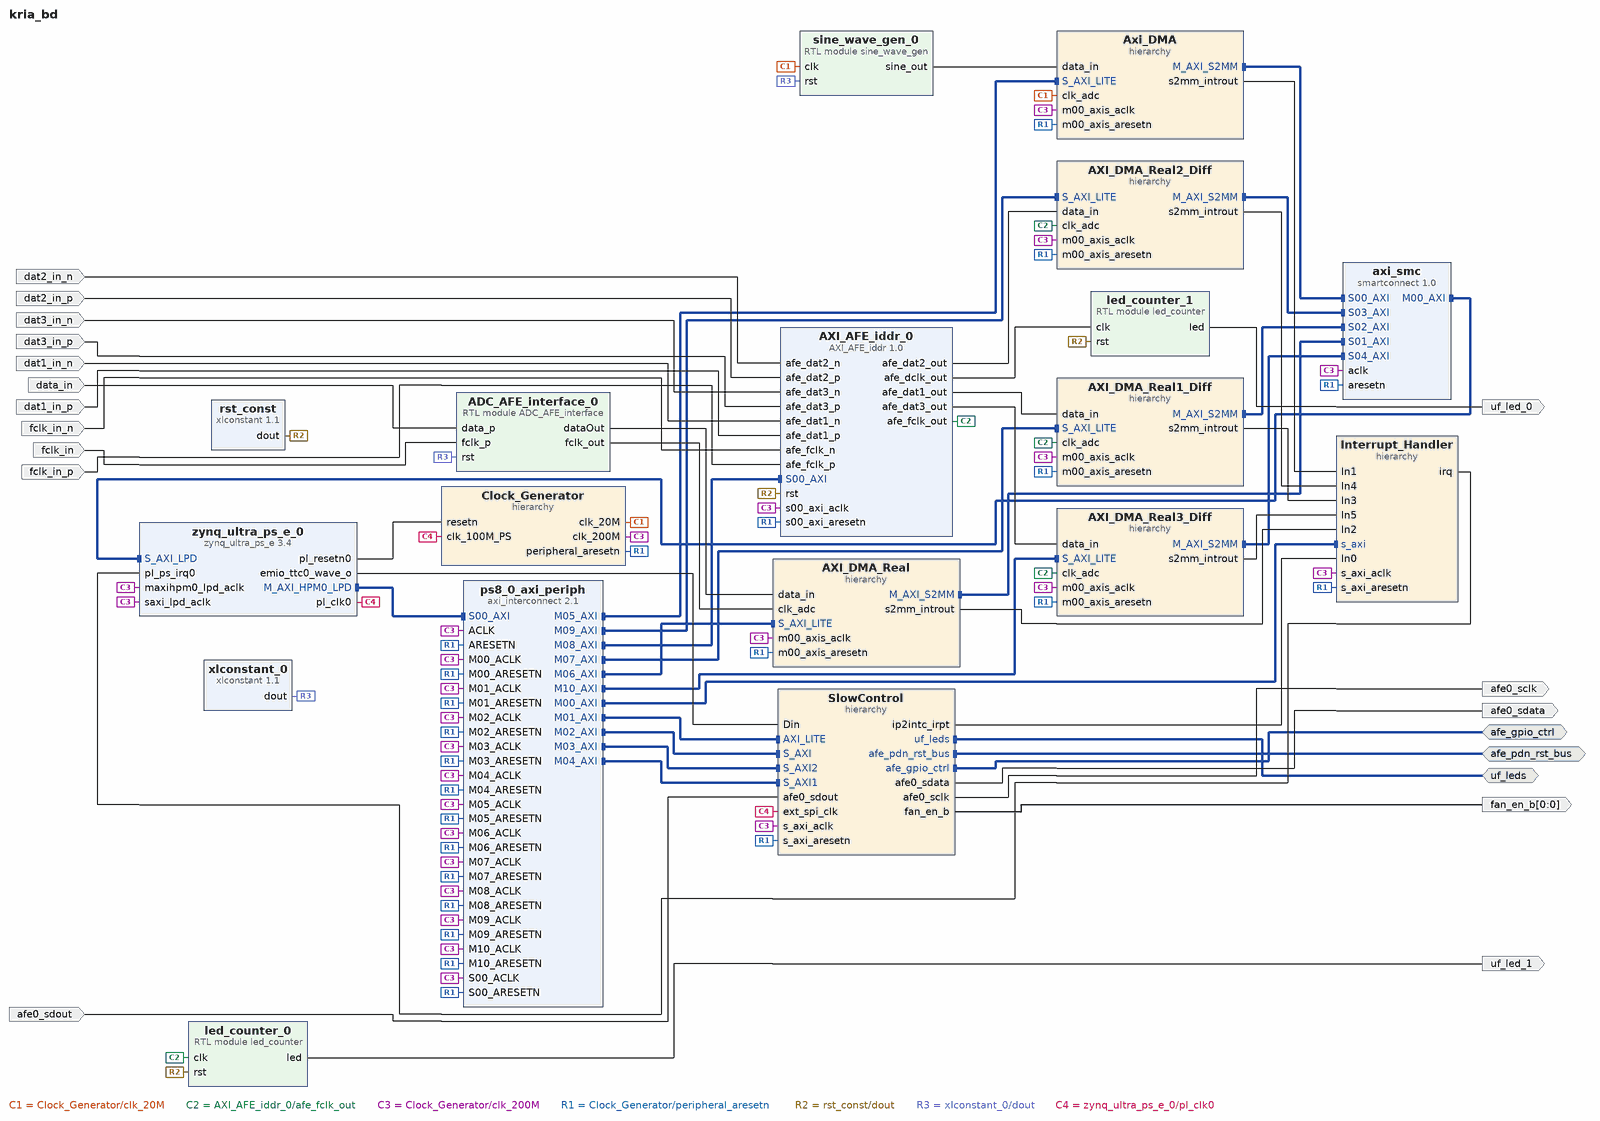
[diagram p0: block diagram of the top level]
# Vivado block design kria_bd, xck26-sfvc784-2LV-c, Vivado 2022.2
create_bd_design kria_bd

create_bd_intf_port -mode Master -vlnv xilinx.com:interface:gpio_rtl:1.0 afe_gpio_ctrl
create_bd_intf_port -mode Master -vlnv xilinx.com:interface:gpio_rtl:1.0 afe_pdn_rst_bus
create_bd_intf_port -mode Master -vlnv xilinx.com:interface:gpio_rtl:1.0 uf_leds
create_bd_port -dir O afe0_sclk
create_bd_port -dir O afe0_sdata
create_bd_port -dir I afe0_sdout
create_bd_port -dir O -from 0 -to 0 fan_en_b
create_bd_port -dir I fclk_in
create_bd_port -dir I data_in
create_bd_port -dir I fclk_in_n
create_bd_port -dir I fclk_in_p
create_bd_port -dir O uf_led_0
create_bd_port -dir O uf_led_1
create_bd_port -dir I dat1_in_p
create_bd_port -dir I dat1_in_n
create_bd_port -dir I dat2_in_p
create_bd_port -dir I dat3_in_n
create_bd_port -dir I dat2_in_n
create_bd_port -dir I dat3_in_p

create_bd_cell -type hier SlowControl
create_bd_cell -type hier Interrupt_Handler
create_bd_cell -type hier Clock_Generator
create_bd_cell -type ip -vlnv xilinx.com:ip:zynq_ultra_ps_e:3.4 zynq_ultra_ps_e_0
set_property -dict [list \
  CONFIG.CAN0_BOARD_INTERFACE custom \
  CONFIG.CAN1_BOARD_INTERFACE custom \
  CONFIG.CSU_BOARD_INTERFACE custom \
  CONFIG.DP_BOARD_INTERFACE custom \
  CONFIG.GEM0_BOARD_INTERFACE custom \
  CONFIG.GEM1_BOARD_INTERFACE custom \
  CONFIG.GEM2_BOARD_INTERFACE custom \
  CONFIG.GEM3_BOARD_INTERFACE custom \
  CONFIG.GPIO_BOARD_INTERFACE custom \
  CONFIG.IIC0_BOARD_INTERFACE custom \
  CONFIG.IIC1_BOARD_INTERFACE custom \
  CONFIG.NAND_BOARD_INTERFACE custom \
  CONFIG.PCIE_BOARD_INTERFACE custom \
  CONFIG.PJTAG_BOARD_INTERFACE custom \
  CONFIG.PMU_BOARD_INTERFACE custom \
  CONFIG.PSU_BANK_0_IO_STANDARD LVCMOS18 \
  CONFIG.PSU_BANK_1_IO_STANDARD LVCMOS18 \
  CONFIG.PSU_BANK_2_IO_STANDARD LVCMOS18 \
  CONFIG.PSU_BANK_3_IO_STANDARD LVCMOS18 \
  CONFIG.PSU_USB3__DUAL_CLOCK_ENABLE 1 \
  CONFIG.PSU__CAN1__PERIPHERAL__ENABLE 0 \
  CONFIG.PSU__CRF_APB__ACPU_CTRL__FREQMHZ 1333.333 \
  CONFIG.PSU__CRF_APB__ACPU_CTRL__SRCSEL APLL \
  CONFIG.PSU__CRF_APB__APLL_CTRL__SRCSEL PSS_REF_CLK \
  CONFIG.PSU__CRF_APB__APLL_FRAC_CFG__ENABLED 1 \
  CONFIG.PSU__CRF_APB__DBG_FPD_CTRL__FREQMHZ 250 \
  CONFIG.PSU__CRF_APB__DBG_FPD_CTRL__SRCSEL IOPLL \
  CONFIG.PSU__CRF_APB__DBG_TRACE_CTRL__FREQMHZ 250 \
  CONFIG.PSU__CRF_APB__DBG_TRACE_CTRL__SRCSEL IOPLL \
  CONFIG.PSU__CRF_APB__DBG_TSTMP_CTRL__FREQMHZ 250 \
  CONFIG.PSU__CRF_APB__DBG_TSTMP_CTRL__SRCSEL IOPLL \
  CONFIG.PSU__CRF_APB__DDR_CTRL__FREQMHZ 1200 \
  CONFIG.PSU__CRF_APB__DDR_CTRL__SRCSEL DPLL \
  CONFIG.PSU__CRF_APB__DPDMA_REF_CTRL__FREQMHZ 600 \
  CONFIG.PSU__CRF_APB__DPDMA_REF_CTRL__SRCSEL APLL \
  CONFIG.PSU__CRF_APB__DPLL_CTRL__SRCSEL PSS_REF_CLK \
  CONFIG.PSU__CRF_APB__DP_AUDIO_REF_CTRL__SRCSEL RPLL \
  CONFIG.PSU__CRF_APB__DP_STC_REF_CTRL__SRCSEL RPLL \
  CONFIG.PSU__CRF_APB__DP_VIDEO_REF_CTRL__SRCSEL VPLL \
  CONFIG.PSU__CRF_APB__GDMA_REF_CTRL__FREQMHZ 600 \
  CONFIG.PSU__CRF_APB__GDMA_REF_CTRL__SRCSEL DPLL \
  CONFIG.PSU__CRF_APB__GPU_REF_CTRL__FREQMHZ 600 \
  CONFIG.PSU__CRF_APB__GPU_REF_CTRL__SRCSEL IOPLL \
  CONFIG.PSU__CRF_APB__TOPSW_LSBUS_CTRL__FREQMHZ 100 \
  CONFIG.PSU__CRF_APB__TOPSW_LSBUS_CTRL__SRCSEL IOPLL \
  CONFIG.PSU__CRF_APB__TOPSW_MAIN_CTRL__FREQMHZ 533.33 \
  CONFIG.PSU__CRF_APB__TOPSW_MAIN_CTRL__SRCSEL DPLL \
  CONFIG.PSU__CRF_APB__VPLL_CTRL__SRCSEL PSS_REF_CLK \
  CONFIG.PSU__CRL_APB__ADMA_REF_CTRL__FREQMHZ 500 \
  CONFIG.PSU__CRL_APB__ADMA_REF_CTRL__SRCSEL IOPLL \
  CONFIG.PSU__CRL_APB__CAN1_REF_CTRL__FREQMHZ 100 \
  CONFIG.PSU__CRL_APB__CAN1_REF_CTRL__SRCSEL IOPLL \
  CONFIG.PSU__CRL_APB__CPU_R5_CTRL__FREQMHZ 533.333 \
  CONFIG.PSU__CRL_APB__CPU_R5_CTRL__SRCSEL RPLL \
  CONFIG.PSU__CRL_APB__DBG_LPD_CTRL__FREQMHZ 250 \
  CONFIG.PSU__CRL_APB__DBG_LPD_CTRL__SRCSEL IOPLL \
  CONFIG.PSU__CRL_APB__GEM3_REF_CTRL__FREQMHZ 125 \
  CONFIG.PSU__CRL_APB__GEM3_REF_CTRL__SRCSEL IOPLL \
  CONFIG.PSU__CRL_APB__I2C0_REF_CTRL__FREQMHZ 100 \
  CONFIG.PSU__CRL_APB__I2C0_REF_CTRL__SRCSEL IOPLL \
  CONFIG.PSU__CRL_APB__I2C1_REF_CTRL__FREQMHZ 100 \
  CONFIG.PSU__CRL_APB__I2C1_REF_CTRL__SRCSEL IOPLL \
  CONFIG.PSU__CRL_APB__IOPLL_CTRL__SRCSEL PSS_REF_CLK \
  CONFIG.PSU__CRL_APB__IOU_SWITCH_CTRL__FREQMHZ 250 \
  CONFIG.PSU__CRL_APB__IOU_SWITCH_CTRL__SRCSEL IOPLL \
  CONFIG.PSU__CRL_APB__LPD_LSBUS_CTRL__FREQMHZ 100 \
  CONFIG.PSU__CRL_APB__LPD_LSBUS_CTRL__SRCSEL IOPLL \
  CONFIG.PSU__CRL_APB__LPD_SWITCH_CTRL__FREQMHZ 500 \
  CONFIG.PSU__CRL_APB__LPD_SWITCH_CTRL__SRCSEL IOPLL \
  CONFIG.PSU__CRL_APB__PCAP_CTRL__FREQMHZ 200 \
  CONFIG.PSU__CRL_APB__PCAP_CTRL__SRCSEL IOPLL \
  CONFIG.PSU__CRL_APB__PL0_REF_CTRL__FREQMHZ 100 \
  CONFIG.PSU__CRL_APB__PL0_REF_CTRL__SRCSEL IOPLL \
  CONFIG.PSU__CRL_APB__PL1_REF_CTRL__SRCSEL IOPLL \
  CONFIG.PSU__CRL_APB__QSPI_REF_CTRL__FREQMHZ 125 \
  CONFIG.PSU__CRL_APB__QSPI_REF_CTRL__SRCSEL IOPLL \
  CONFIG.PSU__CRL_APB__RPLL_CTRL__SRCSEL PSS_REF_CLK \
  CONFIG.PSU__CRL_APB__SDIO1_REF_CTRL__FREQMHZ 200 \
  CONFIG.PSU__CRL_APB__SDIO1_REF_CTRL__SRCSEL RPLL \
  CONFIG.PSU__CRL_APB__SPI1_REF_CTRL__SRCSEL IOPLL \
  CONFIG.PSU__CRL_APB__TIMESTAMP_REF_CTRL__FREQMHZ 100 \
  CONFIG.PSU__CRL_APB__TIMESTAMP_REF_CTRL__SRCSEL IOPLL \
  CONFIG.PSU__CRL_APB__UART0_REF_CTRL__FREQMHZ 100 \
  CONFIG.PSU__CRL_APB__UART0_REF_CTRL__SRCSEL IOPLL \
  CONFIG.PSU__CRL_APB__UART1_REF_CTRL__FREQMHZ 100 \
  CONFIG.PSU__CRL_APB__UART1_REF_CTRL__SRCSEL IOPLL \
  CONFIG.PSU__CRL_APB__USB0_BUS_REF_CTRL__FREQMHZ 250 \
  CONFIG.PSU__CRL_APB__USB0_BUS_REF_CTRL__SRCSEL IOPLL \
  CONFIG.PSU__CRL_APB__USB3_DUAL_REF_CTRL__FREQMHZ 20 \
  CONFIG.PSU__CRL_APB__USB3_DUAL_REF_CTRL__SRCSEL IOPLL \
  CONFIG.PSU__CRL_APB__USB3__ENABLE 1 \
  CONFIG.PSU__CSUPMU__PERIPHERAL__VALID 1 \
  CONFIG.PSU__DDRC__BUS_WIDTH {64 Bit} \
  CONFIG.PSU__DDRC__COMPONENTS Components \
  CONFIG.PSU__DDRC__DEVICE_CAPACITY {8192 MBits} \
  CONFIG.PSU__DDRC__DRAM_WIDTH {16 Bits} \
  CONFIG.PSU__DDRC__ECC Disabled \
  CONFIG.PSU__DDRC__MEMORY_TYPE {DDR 4} \
  CONFIG.PSU__DDRC__SPEED_BIN DDR4_2400R \
  CONFIG.PSU__DDR_HIGH_ADDRESS_GUI_ENABLE 1 \
  CONFIG.PSU__DDR__INTERFACE__FREQMHZ 600.000 \
  CONFIG.PSU__DEVICE_TYPE EV \
  CONFIG.PSU__DISPLAYPORT__LANE0__ENABLE 1 \
  CONFIG.PSU__DISPLAYPORT__LANE0__IO {GT Lane1} \
  CONFIG.PSU__DISPLAYPORT__LANE1__ENABLE 0 \
  CONFIG.PSU__DISPLAYPORT__PERIPHERAL__ENABLE 1 \
  CONFIG.PSU__DLL__ISUSED 0 \
  CONFIG.PSU__DPAUX__PERIPHERAL__ENABLE 1 \
  CONFIG.PSU__DPAUX__PERIPHERAL__IO {MIO 27 .. 30} \
  CONFIG.PSU__DP__LANE_SEL {Single Lower} \
  CONFIG.PSU__DP__REF_CLK_FREQ 27 \
  CONFIG.PSU__DP__REF_CLK_SEL {Ref Clk2} \
  CONFIG.PSU__ENET0__PERIPHERAL__ENABLE 1 \
  CONFIG.PSU__ENET0__PERIPHERAL__IO {GT Lane0} \
  CONFIG.PSU__ENET1__GRP_MDIO__ENABLE 1 \
  CONFIG.PSU__ENET1__GRP_MDIO__IO {MIO 50 .. 51} \
  CONFIG.PSU__ENET1__PERIPHERAL__ENABLE 1 \
  CONFIG.PSU__ENET1__PERIPHERAL__IO {MIO 38 .. 49} \
  CONFIG.PSU__ENET3__PERIPHERAL__ENABLE 0 \
  CONFIG.PSU__FPGA_PL0_ENABLE 1 \
  CONFIG.PSU__FPGA_PL1_ENABLE 1 \
  CONFIG.PSU__GEM0__REF_CLK_FREQ 125 \
  CONFIG.PSU__GEM0__REF_CLK_SEL {Ref Clk1} \
  CONFIG.PSU__GEM__TSU__ENABLE 0 \
  CONFIG.PSU__GPIO0_MIO__IO {MIO 0 .. 25} \
  CONFIG.PSU__GPIO0_MIO__PERIPHERAL__ENABLE 1 \
  CONFIG.PSU__GPIO1_MIO__IO {MIO 26 .. 51} \
  CONFIG.PSU__GPIO1_MIO__PERIPHERAL__ENABLE 1 \
  CONFIG.PSU__GPIO_EMIO__WIDTH {[91:0]} \
  CONFIG.PSU__GT__LINK_SPEED HBR \
  CONFIG.PSU__GT__PRE_EMPH_LVL_4 0 \
  CONFIG.PSU__GT__VLT_SWNG_LVL_4 0 \
  CONFIG.PSU__I2C0__PERIPHERAL__ENABLE 0 \
  CONFIG.PSU__I2C1__PERIPHERAL__ENABLE 1 \
  CONFIG.PSU__I2C1__PERIPHERAL__IO {MIO 24 .. 25} \
  CONFIG.PSU__IOU_SLCR__IOU_TTC_APB_CLK__TTC0_SEL APB \
  CONFIG.PSU__IOU_SLCR__IOU_TTC_APB_CLK__TTC1_SEL APB \
  CONFIG.PSU__IOU_SLCR__IOU_TTC_APB_CLK__TTC2_SEL APB \
  CONFIG.PSU__IOU_SLCR__IOU_TTC_APB_CLK__TTC3_SEL APB \
  CONFIG.PSU__NUM_FABRIC_RESETS 4 \
  CONFIG.PSU__OVERRIDE_HPX_QOS 0 \
  CONFIG.PSU__OVERRIDE__BASIC_CLOCK 0 \
  CONFIG.PSU__PMU_COHERENCY 0 \
  CONFIG.PSU__PMU__AIBACK__ENABLE 0 \
  CONFIG.PSU__PMU__EMIO_GPI__ENABLE 0 \
  CONFIG.PSU__PMU__EMIO_GPO__ENABLE 0 \
  CONFIG.PSU__PMU__GPI0__ENABLE 1 \
  CONFIG.PSU__PMU__GPI0__IO {MIO 26} \
  CONFIG.PSU__PMU__GPI1__ENABLE 0 \
  CONFIG.PSU__PMU__GPI2__ENABLE 0 \
  CONFIG.PSU__PMU__GPI3__ENABLE 0 \
  CONFIG.PSU__PMU__GPI4__ENABLE 0 \
  CONFIG.PSU__PMU__GPI5__ENABLE 1 \
  CONFIG.PSU__PMU__GPI5__IO {MIO 31} \
  CONFIG.PSU__PMU__GPO0__ENABLE 1 \
  CONFIG.PSU__PMU__GPO0__IO {MIO 32} \
  CONFIG.PSU__PMU__GPO1__ENABLE 1 \
  CONFIG.PSU__PMU__GPO1__IO {MIO 33} \
  CONFIG.PSU__PMU__GPO2__ENABLE 1 \
  CONFIG.PSU__PMU__GPO2__IO {MIO 34} \
  CONFIG.PSU__PMU__GPO2__POLARITY high \
  CONFIG.PSU__PMU__GPO3__ENABLE 1 \
  CONFIG.PSU__PMU__GPO3__IO {MIO 35} \
  CONFIG.PSU__PMU__GPO3__POLARITY low \
  CONFIG.PSU__PMU__GPO4__ENABLE 0 \
  CONFIG.PSU__PMU__GPO5__ENABLE 0 \
  CONFIG.PSU__PMU__PERIPHERAL__ENABLE 1 \
  CONFIG.PSU__PMU__PLERROR__ENABLE 0 \
  CONFIG.PSU__PRESET_APPLIED 1 \
  CONFIG.PSU__PSS_REF_CLK__FREQMHZ 33.333 \
  CONFIG.PSU__QSPI_COHERENCY 0 \
  CONFIG.PSU__QSPI_ROUTE_THROUGH_FPD 0 \
  CONFIG.PSU__QSPI__GRP_FBCLK__ENABLE 0 \
  CONFIG.PSU__QSPI__PERIPHERAL__DATA_MODE x4 \
  CONFIG.PSU__QSPI__PERIPHERAL__ENABLE 1 \
  CONFIG.PSU__QSPI__PERIPHERAL__IO {MIO 0 .. 5} \
  CONFIG.PSU__QSPI__PERIPHERAL__MODE Single \
  CONFIG.PSU__SATA__PERIPHERAL__ENABLE 0 \
  CONFIG.PSU__SD0__CLK_100_SDR_OTAP_DLY 0x3 \
  CONFIG.PSU__SD0__CLK_200_SDR_OTAP_DLY 0x3 \
  CONFIG.PSU__SD0__CLK_50_DDR_ITAP_DLY 0x3D \
  CONFIG.PSU__SD0__CLK_50_DDR_OTAP_DLY 0x4 \
  CONFIG.PSU__SD0__CLK_50_SDR_ITAP_DLY 0x15 \
  CONFIG.PSU__SD0__CLK_50_SDR_OTAP_DLY 0x5 \
  CONFIG.PSU__SD1__CLK_100_SDR_OTAP_DLY 0x3 \
  CONFIG.PSU__SD1__CLK_200_SDR_OTAP_DLY 0x3 \
  CONFIG.PSU__SD1__CLK_50_DDR_ITAP_DLY 0x3D \
  CONFIG.PSU__SD1__CLK_50_DDR_OTAP_DLY 0x4 \
  CONFIG.PSU__SD1__CLK_50_SDR_ITAP_DLY 0x15 \
  CONFIG.PSU__SD1__CLK_50_SDR_OTAP_DLY 0x5 \
  CONFIG.PSU__SD1__PERIPHERAL__ENABLE 0 \
  CONFIG.PSU__SPI1__GRP_SS0__IO {MIO 9} \
  CONFIG.PSU__SPI1__PERIPHERAL__ENABLE 1 \
  CONFIG.PSU__SPI1__PERIPHERAL__IO {MIO 6 .. 11} \
  CONFIG.PSU__SWDT0__CLOCK__ENABLE 0 \
  CONFIG.PSU__SWDT0__PERIPHERAL__ENABLE 1 \
  CONFIG.PSU__SWDT0__RESET__ENABLE 0 \
  CONFIG.PSU__SWDT1__CLOCK__ENABLE 0 \
  CONFIG.PSU__SWDT1__PERIPHERAL__ENABLE 1 \
  CONFIG.PSU__SWDT1__RESET__ENABLE 0 \
  CONFIG.PSU__TSU__BUFG_PORT_PAIR 0 \
  CONFIG.PSU__TTC0__CLOCK__ENABLE 0 \
  CONFIG.PSU__TTC0__PERIPHERAL__ENABLE 1 \
  CONFIG.PSU__TTC0__WAVEOUT__ENABLE 1 \
  CONFIG.PSU__TTC0__WAVEOUT__IO EMIO \
  CONFIG.PSU__TTC1__CLOCK__ENABLE 0 \
  CONFIG.PSU__TTC1__PERIPHERAL__ENABLE 1 \
  CONFIG.PSU__TTC1__WAVEOUT__ENABLE 0 \
  CONFIG.PSU__TTC2__CLOCK__ENABLE 0 \
  CONFIG.PSU__TTC2__PERIPHERAL__ENABLE 1 \
  CONFIG.PSU__TTC2__WAVEOUT__ENABLE 0 \
  CONFIG.PSU__TTC3__CLOCK__ENABLE 0 \
  CONFIG.PSU__TTC3__PERIPHERAL__ENABLE 1 \
  CONFIG.PSU__TTC3__WAVEOUT__ENABLE 0 \
  CONFIG.PSU__UART0__PERIPHERAL__ENABLE 0 \
  CONFIG.PSU__UART1__BAUD_RATE 115200 \
  CONFIG.PSU__UART1__MODEM__ENABLE 0 \
  CONFIG.PSU__UART1__PERIPHERAL__ENABLE 1 \
  CONFIG.PSU__UART1__PERIPHERAL__IO {MIO 36 .. 37} \
  CONFIG.PSU__USB0_COHERENCY 0 \
  CONFIG.PSU__USB0__PERIPHERAL__ENABLE 1 \
  CONFIG.PSU__USB0__PERIPHERAL__IO {MIO 52 .. 63} \
  CONFIG.PSU__USB0__REF_CLK_FREQ 26 \
  CONFIG.PSU__USB0__REF_CLK_SEL {Ref Clk3} \
  CONFIG.PSU__USB0__RESET__ENABLE 1 \
  CONFIG.PSU__USB0__RESET__IO {MIO 76} \
  CONFIG.PSU__USB1__PERIPHERAL__ENABLE 1 \
  CONFIG.PSU__USB1__PERIPHERAL__IO {MIO 64 .. 75} \
  CONFIG.PSU__USB1__REF_CLK_FREQ 26 \
  CONFIG.PSU__USB1__REF_CLK_SEL {Ref Clk3} \
  CONFIG.PSU__USB1__RESET__ENABLE 1 \
  CONFIG.PSU__USB1__RESET__IO {MIO 77} \
  CONFIG.PSU__USB2_0__EMIO__ENABLE 0 \
  CONFIG.PSU__USB3_0__EMIO__ENABLE 0 \
  CONFIG.PSU__USB3_0__PERIPHERAL__ENABLE 1 \
  CONFIG.PSU__USB3_0__PERIPHERAL__IO {GT Lane2} \
  CONFIG.PSU__USB3_1__PERIPHERAL__ENABLE 1 \
  CONFIG.PSU__USB3_1__PERIPHERAL__IO {GT Lane3} \
  CONFIG.PSU__USB__RESET__MODE {Separate MIO Pin} \
  CONFIG.PSU__USB__RESET__POLARITY {Active Low} \
  CONFIG.PSU__USE__IRQ0 1 \
  CONFIG.PSU__USE__M_AXI_GP0 0 \
  CONFIG.PSU__USE__M_AXI_GP1 0 \
  CONFIG.PSU__USE__M_AXI_GP2 1 \
  CONFIG.PSU__USE__S_AXI_GP6 1 \
  CONFIG.QSPI_BOARD_INTERFACE custom \
  CONFIG.SATA_BOARD_INTERFACE custom \
  CONFIG.SD0_BOARD_INTERFACE custom \
  CONFIG.SD1_BOARD_INTERFACE custom \
  CONFIG.SPI0_BOARD_INTERFACE custom \
  CONFIG.SPI1_BOARD_INTERFACE custom \
  CONFIG.SUBPRESET1 Custom \
  CONFIG.SUBPRESET2 Custom \
  CONFIG.SWDT0_BOARD_INTERFACE custom \
  CONFIG.SWDT1_BOARD_INTERFACE custom \
  CONFIG.TRACE_BOARD_INTERFACE custom \
  CONFIG.TTC0_BOARD_INTERFACE custom \
  CONFIG.TTC1_BOARD_INTERFACE custom \
  CONFIG.TTC2_BOARD_INTERFACE custom \
  CONFIG.TTC3_BOARD_INTERFACE custom \
  CONFIG.UART0_BOARD_INTERFACE custom \
  CONFIG.UART1_BOARD_INTERFACE custom \
  CONFIG.USB0_BOARD_INTERFACE custom \
  CONFIG.USB1_BOARD_INTERFACE custom \
  CONFIG.preset None \
] [get_bd_cells zynq_ultra_ps_e_0]
# 740 more settings of zynq_ultra_ps_e_0 are not shown: defaults, MIO pin electricals, DDR timing, and values the tool derives
create_bd_cell -type ip -vlnv xilinx.com:ip:axi_interconnect:2.1 ps8_0_axi_periph
set_property -dict {CONFIG.NUM_MI 11} [get_bd_cells ps8_0_axi_periph]
create_bd_cell -type ip -vlnv xilinx.com:ip:xlconstant:1.1 xlconstant_0
set_property -dict {CONFIG.CONST_VAL 0} [get_bd_cells xlconstant_0]
create_bd_cell -type hier Axi_DMA
create_bd_cell -type ip -vlnv xilinx.com:ip:smartconnect:1.0 axi_smc
set_property -dict {CONFIG.NUM_SI 5} [get_bd_cells axi_smc]
create_bd_cell -type hier AXI_DMA_Real
create_bd_cell -type hier AXI_DMA_Real1_Diff
create_bd_cell -type module -reference sine_wave_gen sine_wave_gen_0
create_bd_cell -type module -reference ADC_AFE_interface ADC_AFE_interface_0
create_bd_cell -type ip -vlnv xilinx.com:ip:xlconstant:1.1 rst_const
set_property -dict {CONFIG.CONST_VAL 0} [get_bd_cells rst_const]
create_bd_cell -type module -reference led_counter led_counter_0
create_bd_cell -type module -reference led_counter led_counter_1
create_bd_cell -type hier AXI_DMA_Real2_Diff
create_bd_cell -type hier AXI_DMA_Real3_Diff
create_bd_cell -type ip -vlnv xilinx.com:user:AXI_AFE_iddr:1.0 AXI_AFE_iddr_0
set_property -dict {CONFIG.NUMBER_CHANNELS 3} [get_bd_cells AXI_AFE_iddr_0]

# ---- hierarchy /SlowControl ----
current_bd_instance /SlowControl
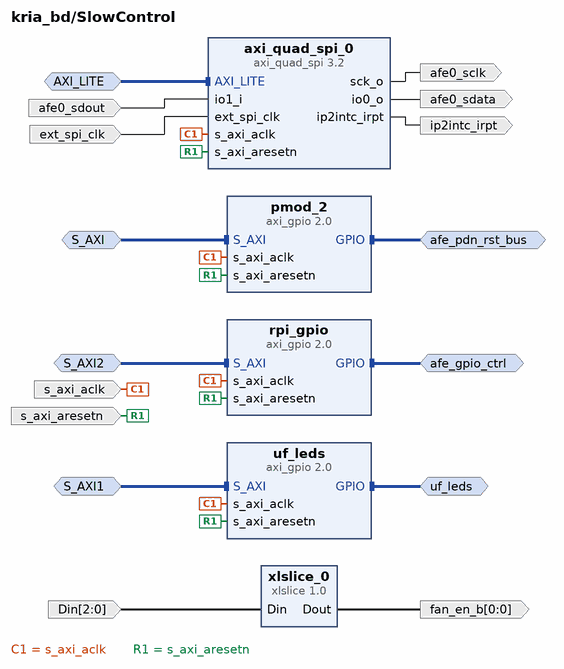
[diagram p1: block diagram inside /SlowControl]
create_bd_intf_pin -mode Slave -vlnv xilinx.com:interface:aximm_rtl:1.0 S_AXI
create_bd_intf_pin -mode Master -vlnv xilinx.com:interface:gpio_rtl:1.0 afe_pdn_rst_bus
create_bd_intf_pin -mode Slave -vlnv xilinx.com:interface:aximm_rtl:1.0 S_AXI1
create_bd_intf_pin -mode Master -vlnv xilinx.com:interface:gpio_rtl:1.0 uf_leds
create_bd_intf_pin -mode Slave -vlnv xilinx.com:interface:aximm_rtl:1.0 S_AXI2
create_bd_intf_pin -mode Master -vlnv xilinx.com:interface:gpio_rtl:1.0 afe_gpio_ctrl
create_bd_intf_pin -mode Slave -vlnv xilinx.com:interface:aximm_rtl:1.0 AXI_LITE
create_bd_pin -dir I -type clk s_axi_aclk
create_bd_pin -dir I -type rst s_axi_aresetn
create_bd_pin -dir I -type clk ext_spi_clk
create_bd_pin -dir O afe0_sdata
create_bd_pin -dir I afe0_sdout
create_bd_pin -dir O afe0_sclk
create_bd_pin -dir O -type intr ip2intc_irpt
create_bd_pin -dir I -from 2 -to 0 Din
create_bd_pin -dir O -from 0 -to 0 fan_en_b

create_bd_cell -type ip -vlnv xilinx.com:ip:axi_gpio:2.0 pmod_2
set_property -dict {CONFIG.C_GPIO_WIDTH 2} [get_bd_cells pmod_2]
create_bd_cell -type ip -vlnv xilinx.com:ip:axi_gpio:2.0 uf_leds
set_property -dict {CONFIG.C_GPIO_WIDTH 2} [get_bd_cells uf_leds]
create_bd_cell -type ip -vlnv xilinx.com:ip:axi_gpio:2.0 rpi_gpio
set_property -dict {CONFIG.C_GPIO_WIDTH 1} [get_bd_cells rpi_gpio]
create_bd_cell -type ip -vlnv xilinx.com:ip:axi_quad_spi:3.2 axi_quad_spi_0
set_property -dict {CONFIG.C_SCK_RATIO 16} [get_bd_cells axi_quad_spi_0]
create_bd_cell -type ip -vlnv xilinx.com:ip:xlslice:1.0 xlslice_0
set_property -dict {CONFIG.DIN_FROM 2 CONFIG.DIN_TO 2 CONFIG.DIN_WIDTH 3} [get_bd_cells xlslice_0]

# ---- hierarchy /Interrupt_Handler ----
current_bd_instance /Interrupt_Handler
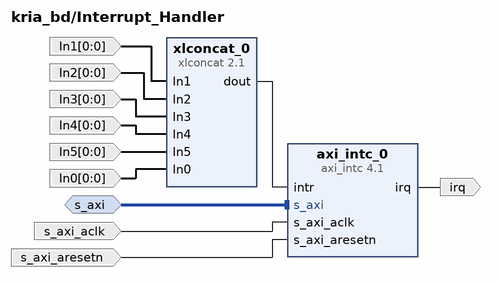
[diagram p2: block diagram inside /Interrupt_Handler]
create_bd_intf_pin -mode Slave -vlnv xilinx.com:interface:aximm_rtl:1.0 s_axi
create_bd_pin -dir I -from 0 -to 0 In0
create_bd_pin -dir I -type clk s_axi_aclk
create_bd_pin -dir I -type rst s_axi_aresetn
create_bd_pin -dir O -type intr irq
create_bd_pin -dir I -from 0 -to 0 In1
create_bd_pin -dir I -from 0 -to 0 In2
create_bd_pin -dir I -from 0 -to 0 In3
create_bd_pin -dir I -from 0 -to 0 In4
create_bd_pin -dir I -from 0 -to 0 In5

create_bd_cell -type ip -vlnv xilinx.com:ip:xlconcat:2.1 xlconcat_0
set_property -dict {CONFIG.NUM_PORTS 6} [get_bd_cells xlconcat_0]
create_bd_cell -type ip -vlnv xilinx.com:ip:axi_intc:4.1 axi_intc_0
set_property -dict {CONFIG.C_IRQ_CONNECTION 1} [get_bd_cells axi_intc_0]

# ---- hierarchy /Clock_Generator ----
current_bd_instance /Clock_Generator
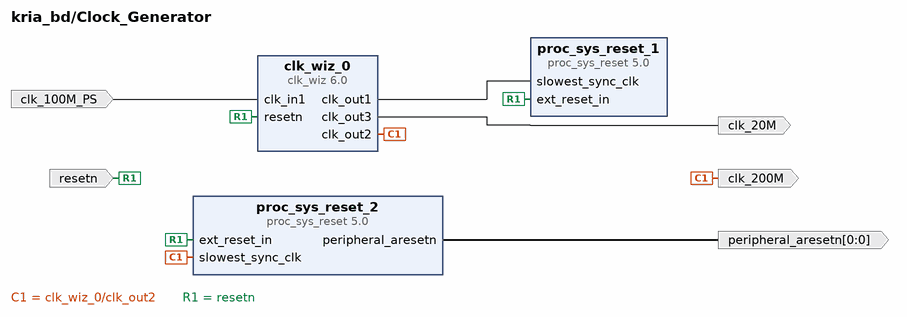
[diagram p3: block diagram inside /Clock_Generator]
create_bd_pin -dir I -type rst resetn
create_bd_pin -dir I -type clk clk_100M_PS
create_bd_pin -dir O -type clk clk_200M
create_bd_pin -dir O -from 0 -to 0 -type rst peripheral_aresetn
create_bd_pin -dir O -type clk clk_20M

create_bd_cell -type ip -vlnv xilinx.com:ip:proc_sys_reset:5.0 proc_sys_reset_1
create_bd_cell -type ip -vlnv xilinx.com:ip:clk_wiz:6.0 clk_wiz_0
set_property -dict [list \
  CONFIG.CLKOUT2_JITTER 102.087 \
  CONFIG.CLKOUT2_PHASE_ERROR 87.181 \
  CONFIG.CLKOUT2_REQUESTED_OUT_FREQ 200.000 \
  CONFIG.CLKOUT2_USED true \
  CONFIG.CLKOUT3_JITTER 162.169 \
  CONFIG.CLKOUT3_PHASE_ERROR 87.181 \
  CONFIG.CLKOUT3_REQUESTED_OUT_FREQ 20 \
  CONFIG.CLKOUT3_USED true \
  CONFIG.MMCM_CLKOUT1_DIVIDE 6 \
  CONFIG.MMCM_CLKOUT2_DIVIDE 60 \
  CONFIG.NUM_OUT_CLKS 3 \
  CONFIG.RESET_PORT resetn \
  CONFIG.RESET_TYPE ACTIVE_LOW \
] [get_bd_cells clk_wiz_0]
create_bd_cell -type ip -vlnv xilinx.com:ip:proc_sys_reset:5.0 proc_sys_reset_2

# ---- hierarchy /Axi_DMA ----
current_bd_instance /Axi_DMA
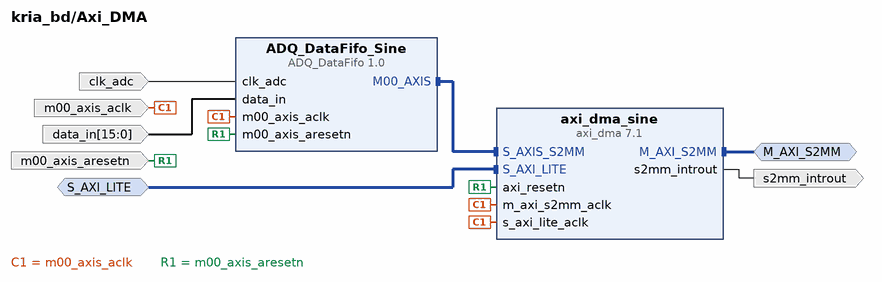
[diagram p4: block diagram inside /Axi_DMA]
create_bd_intf_pin -mode Slave -vlnv xilinx.com:interface:aximm_rtl:1.0 S_AXI_LITE
create_bd_intf_pin -mode Master -vlnv xilinx.com:interface:aximm_rtl:1.0 M_AXI_S2MM
create_bd_pin -dir I -type clk m00_axis_aclk
create_bd_pin -dir I -type rst m00_axis_aresetn
create_bd_pin -dir O -type intr s2mm_introut
create_bd_pin -dir I -from 15 -to 0 data_in
create_bd_pin -dir I clk_adc

create_bd_cell -type ip -vlnv xilinx.com:ip:axi_dma:7.1 axi_dma_sine
set_property -dict [list \
  CONFIG.c_include_mm2s 0 \
  CONFIG.c_include_sg 0 \
  CONFIG.c_s2mm_burst_size 256 \
  CONFIG.c_sg_length_width 16 \
] [get_bd_cells axi_dma_sine]
create_bd_cell -type ip -vlnv fabian.castano:Dune:ADQ_DataFifo:1.0 ADQ_DataFifo_Sine

# ---- hierarchy /AXI_DMA_Real ----
current_bd_instance /AXI_DMA_Real
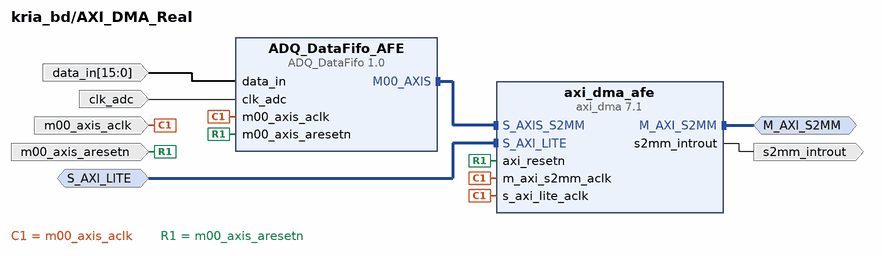
[diagram p5: block diagram inside /AXI_DMA_Real]
create_bd_intf_pin -mode Master -vlnv xilinx.com:interface:aximm_rtl:1.0 M_AXI_S2MM
create_bd_intf_pin -mode Slave -vlnv xilinx.com:interface:aximm_rtl:1.0 S_AXI_LITE
create_bd_pin -dir I -from 15 -to 0 data_in
create_bd_pin -dir I clk_adc
create_bd_pin -dir O -type intr s2mm_introut
create_bd_pin -dir I -type clk m00_axis_aclk
create_bd_pin -dir I -type rst m00_axis_aresetn

create_bd_cell -type ip -vlnv fabian.castano:Dune:ADQ_DataFifo:1.0 ADQ_DataFifo_AFE
create_bd_cell -type ip -vlnv xilinx.com:ip:axi_dma:7.1 axi_dma_afe
set_property -dict [list \
  CONFIG.c_include_mm2s 0 \
  CONFIG.c_include_sg 0 \
  CONFIG.c_s2mm_burst_size 256 \
  CONFIG.c_sg_length_width 16 \
] [get_bd_cells axi_dma_afe]

# ---- hierarchy /AXI_DMA_Real1_Diff ----
current_bd_instance /AXI_DMA_Real1_Diff
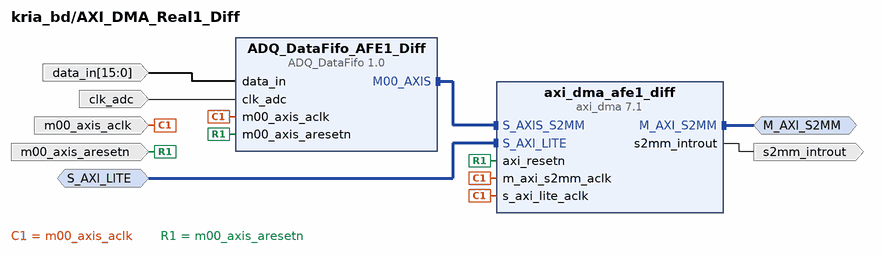
[diagram p6: block diagram inside /AXI_DMA_Real1_Diff]
create_bd_intf_pin -mode Master -vlnv xilinx.com:interface:aximm_rtl:1.0 M_AXI_S2MM
create_bd_intf_pin -mode Slave -vlnv xilinx.com:interface:aximm_rtl:1.0 S_AXI_LITE
create_bd_pin -dir I -from 15 -to 0 data_in
create_bd_pin -dir I clk_adc
create_bd_pin -dir O -type intr s2mm_introut
create_bd_pin -dir I -type clk m00_axis_aclk
create_bd_pin -dir I -type rst m00_axis_aresetn

create_bd_cell -type ip -vlnv fabian.castano:Dune:ADQ_DataFifo:1.0 ADQ_DataFifo_AFE1_Diff
create_bd_cell -type ip -vlnv xilinx.com:ip:axi_dma:7.1 axi_dma_afe1_diff
set_property -dict [list \
  CONFIG.c_include_mm2s 0 \
  CONFIG.c_include_sg 0 \
  CONFIG.c_s2mm_burst_size 256 \
  CONFIG.c_sg_length_width 16 \
] [get_bd_cells axi_dma_afe1_diff]

# ---- hierarchy /AXI_DMA_Real2_Diff ----
current_bd_instance /AXI_DMA_Real2_Diff
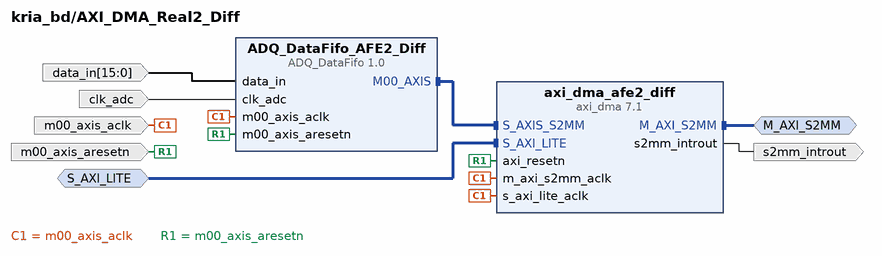
[diagram p7: block diagram inside /AXI_DMA_Real2_Diff]
create_bd_intf_pin -mode Master -vlnv xilinx.com:interface:aximm_rtl:1.0 M_AXI_S2MM
create_bd_intf_pin -mode Slave -vlnv xilinx.com:interface:aximm_rtl:1.0 S_AXI_LITE
create_bd_pin -dir I -from 15 -to 0 data_in
create_bd_pin -dir I clk_adc
create_bd_pin -dir O -type intr s2mm_introut
create_bd_pin -dir I -type clk m00_axis_aclk
create_bd_pin -dir I -type rst m00_axis_aresetn

create_bd_cell -type ip -vlnv fabian.castano:Dune:ADQ_DataFifo:1.0 ADQ_DataFifo_AFE2_Diff
create_bd_cell -type ip -vlnv xilinx.com:ip:axi_dma:7.1 axi_dma_afe2_diff
set_property -dict [list \
  CONFIG.c_include_mm2s 0 \
  CONFIG.c_include_sg 0 \
  CONFIG.c_s2mm_burst_size 256 \
  CONFIG.c_sg_length_width 16 \
] [get_bd_cells axi_dma_afe2_diff]

# ---- hierarchy /AXI_DMA_Real3_Diff ----
current_bd_instance /AXI_DMA_Real3_Diff
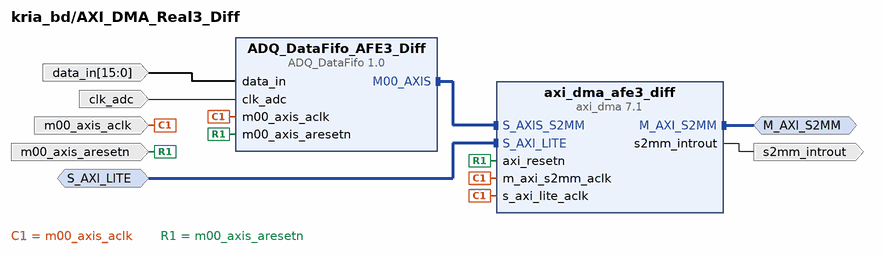
[diagram p8: block diagram inside /AXI_DMA_Real3_Diff]
create_bd_intf_pin -mode Master -vlnv xilinx.com:interface:aximm_rtl:1.0 M_AXI_S2MM
create_bd_intf_pin -mode Slave -vlnv xilinx.com:interface:aximm_rtl:1.0 S_AXI_LITE
create_bd_pin -dir I -from 15 -to 0 data_in
create_bd_pin -dir I clk_adc
create_bd_pin -dir O -type intr s2mm_introut
create_bd_pin -dir I -type clk m00_axis_aclk
create_bd_pin -dir I -type rst m00_axis_aresetn

create_bd_cell -type ip -vlnv fabian.castano:Dune:ADQ_DataFifo:1.0 ADQ_DataFifo_AFE3_Diff
create_bd_cell -type ip -vlnv xilinx.com:ip:axi_dma:7.1 axi_dma_afe3_diff
set_property -dict [list \
  CONFIG.c_include_mm2s 0 \
  CONFIG.c_include_sg 0 \
  CONFIG.c_s2mm_burst_size 256 \
  CONFIG.c_sg_length_width 16 \
] [get_bd_cells axi_dma_afe3_diff]

# ---- connections ----

current_bd_instance /SlowControl
connect_bd_intf_net -intf_net axi_gpio_0_GPIO [get_bd_intf_pins uf_leds] [get_bd_intf_pins uf_leds/GPIO]
connect_bd_intf_net [get_bd_intf_pins afe_pdn_rst_bus] [get_bd_intf_pins pmod_2/GPIO]
connect_bd_intf_net [get_bd_intf_pins AXI_LITE] [get_bd_intf_pins axi_quad_spi_0/AXI_LITE]
connect_bd_intf_net [get_bd_intf_pins S_AXI] [get_bd_intf_pins pmod_2/S_AXI]
connect_bd_intf_net [get_bd_intf_pins S_AXI2] [get_bd_intf_pins rpi_gpio/S_AXI]
connect_bd_intf_net [get_bd_intf_pins S_AXI1] [get_bd_intf_pins uf_leds/S_AXI]
connect_bd_intf_net [get_bd_intf_pins afe_gpio_ctrl] [get_bd_intf_pins rpi_gpio/GPIO]
connect_bd_net [get_bd_pins axi_quad_spi_0/io0_o] [get_bd_pins afe0_sdata]
connect_bd_net [get_bd_pins axi_quad_spi_0/ip2intc_irpt] [get_bd_pins ip2intc_irpt]
connect_bd_net [get_bd_pins axi_quad_spi_0/sck_o] [get_bd_pins afe0_sclk]
connect_bd_net -net clk_wiz_0_clk_out2 [get_bd_pins s_axi_aclk] \
  [get_bd_pins axi_quad_spi_0/s_axi_aclk] [get_bd_pins rpi_gpio/s_axi_aclk] [get_bd_pins uf_leds/s_axi_aclk] \
  [get_bd_pins pmod_2/s_axi_aclk]
connect_bd_net -net io1_i_0_1 [get_bd_pins afe0_sdout] [get_bd_pins axi_quad_spi_0/io1_i]
connect_bd_net -net proc_sys_reset_2_peripheral_aresetn [get_bd_pins s_axi_aresetn] \
  [get_bd_pins axi_quad_spi_0/s_axi_aresetn] [get_bd_pins rpi_gpio/s_axi_aresetn] [get_bd_pins uf_leds/s_axi_aresetn] \
  [get_bd_pins pmod_2/s_axi_aresetn]
connect_bd_net [get_bd_pins xlslice_0/Dout] [get_bd_pins fan_en_b]
connect_bd_net -net zynq_ultra_ps_e_0_emio_ttc0_wave_o [get_bd_pins Din] [get_bd_pins xlslice_0/Din]
connect_bd_net -net zynq_ultra_ps_e_0_pl_clk0 [get_bd_pins ext_spi_clk] [get_bd_pins axi_quad_spi_0/ext_spi_clk]

current_bd_instance /Interrupt_Handler
connect_bd_intf_net [get_bd_intf_pins s_axi] [get_bd_intf_pins axi_intc_0/s_axi]
connect_bd_net -net In1_1 [get_bd_pins In1] [get_bd_pins xlconcat_0/In1]
connect_bd_net -net In2_1 [get_bd_pins In2] [get_bd_pins xlconcat_0/In2]
connect_bd_net -net In3_1 [get_bd_pins In3] [get_bd_pins xlconcat_0/In3]
connect_bd_net -net In4_1 [get_bd_pins In4] [get_bd_pins xlconcat_0/In4]
connect_bd_net -net In5_1 [get_bd_pins In5] [get_bd_pins xlconcat_0/In5]
connect_bd_net [get_bd_pins axi_intc_0/irq] [get_bd_pins irq]
connect_bd_net -net axi_quad_spi_0_ip2intc_irpt [get_bd_pins In0] [get_bd_pins xlconcat_0/In0]
connect_bd_net -net clk_wiz_0_clk_out2 [get_bd_pins s_axi_aclk] [get_bd_pins axi_intc_0/s_axi_aclk]
connect_bd_net -net proc_sys_reset_2_peripheral_aresetn [get_bd_pins s_axi_aresetn] [get_bd_pins axi_intc_0/s_axi_aresetn]
connect_bd_net [get_bd_pins xlconcat_0/dout] [get_bd_pins axi_intc_0/intr]

current_bd_instance /Clock_Generator
connect_bd_net [get_bd_pins clk_wiz_0/clk_out1] [get_bd_pins proc_sys_reset_1/slowest_sync_clk]
connect_bd_net [get_bd_pins clk_wiz_0/clk_out2] [get_bd_pins clk_200M] [get_bd_pins proc_sys_reset_2/slowest_sync_clk]
connect_bd_net [get_bd_pins clk_wiz_0/clk_out3] [get_bd_pins clk_20M]
connect_bd_net [get_bd_pins proc_sys_reset_2/peripheral_aresetn] [get_bd_pins peripheral_aresetn]
connect_bd_net -net zynq_ultra_ps_e_0_pl_clk0 [get_bd_pins clk_100M_PS] [get_bd_pins clk_wiz_0/clk_in1]
connect_bd_net -net zynq_ultra_ps_e_0_pl_resetn0 [get_bd_pins resetn] \
  [get_bd_pins clk_wiz_0/resetn] [get_bd_pins proc_sys_reset_2/ext_reset_in] [get_bd_pins proc_sys_reset_1/ext_reset_in]
set_property PFM.CLOCK {clk_out1 {id "0" is_default "false" proc_sys_reset "/Clock_Generator/proc_sys_reset_1" status "fixed" freq_hz "100000000"} clk_out2 {id "1" is_default "true" proc_sys_reset "/Clock_Generator/proc_sys_reset_2" status "fixed" freq_hz "200000000"}} [get_bd_cells clk_wiz_0]

current_bd_instance /Axi_DMA
connect_bd_intf_net -intf_net ADQ_DataFifo_0_M00_AXIS [get_bd_intf_pins ADQ_DataFifo_Sine/M00_AXIS] [get_bd_intf_pins axi_dma_sine/S_AXIS_S2MM]
connect_bd_intf_net [get_bd_intf_pins M_AXI_S2MM] [get_bd_intf_pins axi_dma_sine/M_AXI_S2MM]
connect_bd_intf_net [get_bd_intf_pins S_AXI_LITE] [get_bd_intf_pins axi_dma_sine/S_AXI_LITE]
connect_bd_net -net Clock_Generator_clk_out3 [get_bd_pins clk_adc] [get_bd_pins ADQ_DataFifo_Sine/clk_adc]
connect_bd_net -net axi_dma_afe_s2mm_introut [get_bd_pins axi_dma_sine/s2mm_introut] [get_bd_pins s2mm_introut]
connect_bd_net -net clk_wiz_0_clk_out2 [get_bd_pins m00_axis_aclk] \
  [get_bd_pins ADQ_DataFifo_Sine/m00_axis_aclk] [get_bd_pins axi_dma_sine/m_axi_s2mm_aclk] \
  [get_bd_pins axi_dma_sine/s_axi_lite_aclk]
connect_bd_net -net proc_sys_reset_2_peripheral_aresetn [get_bd_pins m00_axis_aresetn] \
  [get_bd_pins ADQ_DataFifo_Sine/m00_axis_aresetn] [get_bd_pins axi_dma_sine/axi_resetn]
connect_bd_net -net sine_wave_gen_0_sine_out [get_bd_pins data_in] [get_bd_pins ADQ_DataFifo_Sine/data_in]

current_bd_instance /AXI_DMA_Real
connect_bd_intf_net [get_bd_intf_pins ADQ_DataFifo_AFE/M00_AXIS] [get_bd_intf_pins axi_dma_afe/S_AXIS_S2MM]
connect_bd_intf_net [get_bd_intf_pins M_AXI_S2MM] [get_bd_intf_pins axi_dma_afe/M_AXI_S2MM]
connect_bd_intf_net [get_bd_intf_pins S_AXI_LITE] [get_bd_intf_pins axi_dma_afe/S_AXI_LITE]
connect_bd_net -net ADC_AFE_interface_0_dataOut [get_bd_pins data_in] [get_bd_pins ADQ_DataFifo_AFE/data_in]
connect_bd_net -net ADC_AFE_interface_0_fclk_out [get_bd_pins clk_adc] [get_bd_pins ADQ_DataFifo_AFE/clk_adc]
connect_bd_net [get_bd_pins axi_dma_afe/s2mm_introut] [get_bd_pins s2mm_introut]
connect_bd_net [get_bd_pins m00_axis_aclk] \
  [get_bd_pins ADQ_DataFifo_AFE/m00_axis_aclk] [get_bd_pins axi_dma_afe/m_axi_s2mm_aclk] \
  [get_bd_pins axi_dma_afe/s_axi_lite_aclk]
connect_bd_net [get_bd_pins m00_axis_aresetn] [get_bd_pins ADQ_DataFifo_AFE/m00_axis_aresetn] [get_bd_pins axi_dma_afe/axi_resetn]

current_bd_instance /AXI_DMA_Real1_Diff
connect_bd_intf_net -intf_net ADQ_DataFifo_AFE_M00_AXIS [get_bd_intf_pins ADQ_DataFifo_AFE1_Diff/M00_AXIS] [get_bd_intf_pins axi_dma_afe1_diff/S_AXIS_S2MM]
connect_bd_intf_net [get_bd_intf_pins M_AXI_S2MM] [get_bd_intf_pins axi_dma_afe1_diff/M_AXI_S2MM]
connect_bd_intf_net [get_bd_intf_pins S_AXI_LITE] [get_bd_intf_pins axi_dma_afe1_diff/S_AXI_LITE]
connect_bd_net -net ADC_AFE_interface_0_dataOut [get_bd_pins data_in] [get_bd_pins ADQ_DataFifo_AFE1_Diff/data_in]
connect_bd_net -net ADC_AFE_interface_0_fclk_out [get_bd_pins clk_adc] [get_bd_pins ADQ_DataFifo_AFE1_Diff/clk_adc]
connect_bd_net -net axi_dma_afe_s2mm_introut1 [get_bd_pins axi_dma_afe1_diff/s2mm_introut] [get_bd_pins s2mm_introut]
connect_bd_net [get_bd_pins m00_axis_aclk] \
  [get_bd_pins ADQ_DataFifo_AFE1_Diff/m00_axis_aclk] [get_bd_pins axi_dma_afe1_diff/m_axi_s2mm_aclk] \
  [get_bd_pins axi_dma_afe1_diff/s_axi_lite_aclk]
connect_bd_net [get_bd_pins m00_axis_aresetn] [get_bd_pins ADQ_DataFifo_AFE1_Diff/m00_axis_aresetn] [get_bd_pins axi_dma_afe1_diff/axi_resetn]

current_bd_instance /AXI_DMA_Real2_Diff
connect_bd_intf_net -intf_net ADQ_DataFifo_AFE_M00_AXIS [get_bd_intf_pins ADQ_DataFifo_AFE2_Diff/M00_AXIS] [get_bd_intf_pins axi_dma_afe2_diff/S_AXIS_S2MM]
connect_bd_intf_net [get_bd_intf_pins M_AXI_S2MM] [get_bd_intf_pins axi_dma_afe2_diff/M_AXI_S2MM]
connect_bd_intf_net [get_bd_intf_pins S_AXI_LITE] [get_bd_intf_pins axi_dma_afe2_diff/S_AXI_LITE]
connect_bd_net -net ADC_AFE_interface_0_dataOut [get_bd_pins data_in] [get_bd_pins ADQ_DataFifo_AFE2_Diff/data_in]
connect_bd_net -net ADC_AFE_interface_0_fclk_out [get_bd_pins clk_adc] [get_bd_pins ADQ_DataFifo_AFE2_Diff/clk_adc]
connect_bd_net -net axi_dma_afe_s2mm_introut1 [get_bd_pins axi_dma_afe2_diff/s2mm_introut] [get_bd_pins s2mm_introut]
connect_bd_net [get_bd_pins m00_axis_aclk] \
  [get_bd_pins ADQ_DataFifo_AFE2_Diff/m00_axis_aclk] [get_bd_pins axi_dma_afe2_diff/m_axi_s2mm_aclk] \
  [get_bd_pins axi_dma_afe2_diff/s_axi_lite_aclk]
connect_bd_net [get_bd_pins m00_axis_aresetn] [get_bd_pins ADQ_DataFifo_AFE2_Diff/m00_axis_aresetn] [get_bd_pins axi_dma_afe2_diff/axi_resetn]

current_bd_instance /AXI_DMA_Real3_Diff
connect_bd_intf_net -intf_net ADQ_DataFifo_AFE_M00_AXIS [get_bd_intf_pins ADQ_DataFifo_AFE3_Diff/M00_AXIS] [get_bd_intf_pins axi_dma_afe3_diff/S_AXIS_S2MM]
connect_bd_intf_net [get_bd_intf_pins M_AXI_S2MM] [get_bd_intf_pins axi_dma_afe3_diff/M_AXI_S2MM]
connect_bd_intf_net [get_bd_intf_pins S_AXI_LITE] [get_bd_intf_pins axi_dma_afe3_diff/S_AXI_LITE]
connect_bd_net -net ADC_AFE_interface_0_dataOut [get_bd_pins data_in] [get_bd_pins ADQ_DataFifo_AFE3_Diff/data_in]
connect_bd_net -net ADC_AFE_interface_0_fclk_out [get_bd_pins clk_adc] [get_bd_pins ADQ_DataFifo_AFE3_Diff/clk_adc]
connect_bd_net -net axi_dma_afe_s2mm_introut1 [get_bd_pins axi_dma_afe3_diff/s2mm_introut] [get_bd_pins s2mm_introut]
connect_bd_net [get_bd_pins m00_axis_aclk] \
  [get_bd_pins ADQ_DataFifo_AFE3_Diff/m00_axis_aclk] [get_bd_pins axi_dma_afe3_diff/m_axi_s2mm_aclk] \
  [get_bd_pins axi_dma_afe3_diff/s_axi_lite_aclk]
connect_bd_net [get_bd_pins m00_axis_aresetn] [get_bd_pins ADQ_DataFifo_AFE3_Diff/m00_axis_aresetn] [get_bd_pins axi_dma_afe3_diff/axi_resetn]

current_bd_instance /
connect_bd_intf_net [get_bd_intf_pins AXI_DMA_Real2_Diff/M_AXI_S2MM] [get_bd_intf_pins axi_smc/S03_AXI]
connect_bd_intf_net [get_bd_intf_pins AXI_DMA_Real3_Diff/M_AXI_S2MM] [get_bd_intf_pins axi_smc/S04_AXI]
connect_bd_intf_net -intf_net AXI_DMA_Real_Diff_M_AXI_S2MM [get_bd_intf_pins AXI_DMA_Real1_Diff/M_AXI_S2MM] [get_bd_intf_pins axi_smc/S02_AXI]
connect_bd_intf_net [get_bd_intf_pins axi_smc/S01_AXI] [get_bd_intf_pins AXI_DMA_Real/M_AXI_S2MM]
connect_bd_intf_net [get_bd_intf_pins axi_smc/S00_AXI] [get_bd_intf_pins Axi_DMA/M_AXI_S2MM]
connect_bd_intf_net [get_bd_intf_ports uf_leds] [get_bd_intf_pins SlowControl/uf_leds]
connect_bd_intf_net [get_bd_intf_pins zynq_ultra_ps_e_0/S_AXI_LPD] [get_bd_intf_pins axi_smc/M00_AXI]
connect_bd_intf_net -intf_net pmod_2_GPIO [get_bd_intf_ports afe_pdn_rst_bus] [get_bd_intf_pins SlowControl/afe_pdn_rst_bus]
connect_bd_intf_net [get_bd_intf_pins Interrupt_Handler/s_axi] [get_bd_intf_pins ps8_0_axi_periph/M00_AXI]
connect_bd_intf_net [get_bd_intf_pins SlowControl/AXI_LITE] [get_bd_intf_pins ps8_0_axi_periph/M01_AXI]
connect_bd_intf_net [get_bd_intf_pins SlowControl/S_AXI] [get_bd_intf_pins ps8_0_axi_periph/M02_AXI]
connect_bd_intf_net [get_bd_intf_pins ps8_0_axi_periph/M03_AXI] [get_bd_intf_pins SlowControl/S_AXI2]
connect_bd_intf_net [get_bd_intf_pins ps8_0_axi_periph/M04_AXI] [get_bd_intf_pins SlowControl/S_AXI1]
connect_bd_intf_net [get_bd_intf_pins ps8_0_axi_periph/M05_AXI] [get_bd_intf_pins Axi_DMA/S_AXI_LITE]
connect_bd_intf_net [get_bd_intf_pins ps8_0_axi_periph/M06_AXI] [get_bd_intf_pins AXI_DMA_Real/S_AXI_LITE]
connect_bd_intf_net [get_bd_intf_pins ps8_0_axi_periph/M07_AXI] [get_bd_intf_pins AXI_DMA_Real1_Diff/S_AXI_LITE]
connect_bd_intf_net [get_bd_intf_pins ps8_0_axi_periph/M08_AXI] [get_bd_intf_pins AXI_AFE_iddr_0/S00_AXI]
connect_bd_intf_net [get_bd_intf_pins ps8_0_axi_periph/M09_AXI] [get_bd_intf_pins AXI_DMA_Real2_Diff/S_AXI_LITE]
connect_bd_intf_net [get_bd_intf_pins ps8_0_axi_periph/M10_AXI] [get_bd_intf_pins AXI_DMA_Real3_Diff/S_AXI_LITE]
connect_bd_intf_net -intf_net rpi_gpio_GPIO [get_bd_intf_ports afe_gpio_ctrl] [get_bd_intf_pins SlowControl/afe_gpio_ctrl]
connect_bd_intf_net [get_bd_intf_pins ps8_0_axi_periph/S00_AXI] [get_bd_intf_pins zynq_ultra_ps_e_0/M_AXI_HPM0_LPD]
connect_bd_net [get_bd_pins ADC_AFE_interface_0/dataOut] [get_bd_pins AXI_DMA_Real/data_in]
connect_bd_net [get_bd_pins ADC_AFE_interface_0/fclk_out] [get_bd_pins AXI_DMA_Real/clk_adc]
connect_bd_net -net AXI_AFE_iddr_0_afe_data_out [get_bd_pins AXI_AFE_iddr_0/afe_dat1_out] [get_bd_pins AXI_DMA_Real1_Diff/data_in]
connect_bd_net [get_bd_pins AXI_AFE_iddr_0/afe_dclk_out] [get_bd_pins led_counter_1/clk]
connect_bd_net [get_bd_pins AXI_DMA_Real2_Diff/s2mm_introut] [get_bd_pins Interrupt_Handler/In4]
connect_bd_net [get_bd_pins AXI_DMA_Real3_Diff/s2mm_introut] [get_bd_pins Interrupt_Handler/In5]
connect_bd_net -net AXI_DMA_Real_Diff_s2mm_introut [get_bd_pins AXI_DMA_Real1_Diff/s2mm_introut] [get_bd_pins Interrupt_Handler/In3]
connect_bd_net -net Clock_Generator_clk_out3 [get_bd_pins Clock_Generator/clk_20M] [get_bd_pins Axi_DMA/clk_adc] [get_bd_pins sine_wave_gen_0/clk]
connect_bd_net -net afe_clk_data_input_0_fclk_out [get_bd_pins AXI_AFE_iddr_0/afe_fclk_out] \
  [get_bd_pins AXI_DMA_Real1_Diff/clk_adc] [get_bd_pins led_counter_0/clk] [get_bd_pins AXI_DMA_Real3_Diff/clk_adc] \
  [get_bd_pins AXI_DMA_Real2_Diff/clk_adc]
connect_bd_net -net afe_dat2_n_0_1 [get_bd_ports dat2_in_n] [get_bd_pins AXI_AFE_iddr_0/afe_dat2_n]
connect_bd_net -net afe_dat2_p_0_1 [get_bd_ports dat2_in_p] [get_bd_pins AXI_AFE_iddr_0/afe_dat2_p]
connect_bd_net -net afe_dat3_n_0_1 [get_bd_ports dat3_in_n] [get_bd_pins AXI_AFE_iddr_0/afe_dat3_n]
connect_bd_net -net afe_dat3_p_0_1 [get_bd_ports dat3_in_p] [get_bd_pins AXI_AFE_iddr_0/afe_dat3_p]
connect_bd_net -net axi_dma_afe_s2mm_introut [get_bd_pins Axi_DMA/s2mm_introut] [get_bd_pins Interrupt_Handler/In1]
connect_bd_net -net axi_dma_afe_s2mm_introut1 [get_bd_pins AXI_DMA_Real/s2mm_introut] [get_bd_pins Interrupt_Handler/In2]
connect_bd_net -net axi_intc_0_irq [get_bd_pins Interrupt_Handler/irq] [get_bd_pins zynq_ultra_ps_e_0/pl_ps_irq0]
connect_bd_net -net axi_quad_spi_0_io0_o [get_bd_pins SlowControl/afe0_sdata] [get_bd_ports afe0_sdata]
connect_bd_net -net axi_quad_spi_0_ip2intc_irpt [get_bd_pins SlowControl/ip2intc_irpt] [get_bd_pins Interrupt_Handler/In0]
connect_bd_net -net axi_quad_spi_0_sck_o [get_bd_pins SlowControl/afe0_sclk] [get_bd_ports afe0_sclk]
connect_bd_net -net clk_wiz_0_clk_out2 [get_bd_pins Clock_Generator/clk_200M] \
  [get_bd_pins SlowControl/s_axi_aclk] [get_bd_pins Interrupt_Handler/s_axi_aclk] \
  [get_bd_pins zynq_ultra_ps_e_0/maxihpm0_lpd_aclk] [get_bd_pins ps8_0_axi_periph/S00_ACLK] \
  [get_bd_pins ps8_0_axi_periph/M04_ACLK] [get_bd_pins ps8_0_axi_periph/M03_ACLK] [get_bd_pins ps8_0_axi_periph/M02_ACLK] \
  [get_bd_pins ps8_0_axi_periph/M01_ACLK] [get_bd_pins ps8_0_axi_periph/M00_ACLK] [get_bd_pins ps8_0_axi_periph/ACLK] \
  [get_bd_pins zynq_ultra_ps_e_0/saxi_lpd_aclk] [get_bd_pins ps8_0_axi_periph/M05_ACLK] [get_bd_pins Axi_DMA/m00_axis_aclk] \
  [get_bd_pins axi_smc/aclk] [get_bd_pins AXI_DMA_Real/m00_axis_aclk] [get_bd_pins ps8_0_axi_periph/M06_ACLK] \
  [get_bd_pins AXI_DMA_Real1_Diff/m00_axis_aclk] [get_bd_pins ps8_0_axi_periph/M07_ACLK] \
  [get_bd_pins ps8_0_axi_periph/M08_ACLK] [get_bd_pins AXI_DMA_Real2_Diff/m00_axis_aclk] \
  [get_bd_pins ps8_0_axi_periph/M09_ACLK] [get_bd_pins AXI_DMA_Real3_Diff/m00_axis_aclk] \
  [get_bd_pins ps8_0_axi_periph/M10_ACLK] [get_bd_pins AXI_AFE_iddr_0/s00_axi_aclk]
connect_bd_net -net data_in_1 [get_bd_pins AXI_AFE_iddr_0/afe_dat2_out] [get_bd_pins AXI_DMA_Real2_Diff/data_in]
connect_bd_net -net data_in_2 [get_bd_pins AXI_AFE_iddr_0/afe_dat3_out] [get_bd_pins AXI_DMA_Real3_Diff/data_in]
connect_bd_net -net data_in_n_1 [get_bd_ports dat1_in_n] [get_bd_pins AXI_AFE_iddr_0/afe_dat1_n]
connect_bd_net -net data_in_p_1 [get_bd_ports dat1_in_p] [get_bd_pins AXI_AFE_iddr_0/afe_dat1_p]
connect_bd_net -net data_p_0_1 [get_bd_ports data_in] [get_bd_pins ADC_AFE_interface_0/data_p]
connect_bd_net [get_bd_ports fclk_in_n] [get_bd_pins AXI_AFE_iddr_0/afe_fclk_n]
connect_bd_net [get_bd_ports fclk_in_p] [get_bd_pins AXI_AFE_iddr_0/afe_fclk_p]
connect_bd_net -net fclk_p_0_1 [get_bd_ports fclk_in] [get_bd_pins ADC_AFE_interface_0/fclk_p]
connect_bd_net -net io1_i_0_1 [get_bd_ports afe0_sdout] [get_bd_pins SlowControl/afe0_sdout]
connect_bd_net [get_bd_pins led_counter_0/led] [get_bd_ports uf_led_1]
connect_bd_net [get_bd_pins led_counter_1/led] [get_bd_ports uf_led_0]
connect_bd_net -net proc_sys_reset_2_peripheral_aresetn [get_bd_pins Clock_Generator/peripheral_aresetn] \
  [get_bd_pins SlowControl/s_axi_aresetn] [get_bd_pins Interrupt_Handler/s_axi_aresetn] \
  [get_bd_pins ps8_0_axi_periph/ARESETN] [get_bd_pins ps8_0_axi_periph/S00_ARESETN] \
  [get_bd_pins ps8_0_axi_periph/M04_ARESETN] [get_bd_pins ps8_0_axi_periph/M03_ARESETN] \
  [get_bd_pins ps8_0_axi_periph/M02_ARESETN] [get_bd_pins ps8_0_axi_periph/M01_ARESETN] \
  [get_bd_pins ps8_0_axi_periph/M00_ARESETN] [get_bd_pins ps8_0_axi_periph/M05_ARESETN] \
  [get_bd_pins Axi_DMA/m00_axis_aresetn] [get_bd_pins axi_smc/aresetn] [get_bd_pins AXI_DMA_Real/m00_axis_aresetn] \
  [get_bd_pins ps8_0_axi_periph/M06_ARESETN] [get_bd_pins AXI_DMA_Real1_Diff/m00_axis_aresetn] \
  [get_bd_pins ps8_0_axi_periph/M07_ARESETN] [get_bd_pins ps8_0_axi_periph/M08_ARESETN] \
  [get_bd_pins AXI_DMA_Real2_Diff/m00_axis_aresetn] [get_bd_pins ps8_0_axi_periph/M09_ARESETN] \
  [get_bd_pins AXI_DMA_Real3_Diff/m00_axis_aresetn] [get_bd_pins ps8_0_axi_periph/M10_ARESETN] \
  [get_bd_pins AXI_AFE_iddr_0/s00_axi_aresetn]
connect_bd_net [get_bd_pins rst_const/dout] [get_bd_pins led_counter_0/rst] [get_bd_pins led_counter_1/rst] [get_bd_pins AXI_AFE_iddr_0/rst]
connect_bd_net [get_bd_pins sine_wave_gen_0/sine_out] [get_bd_pins Axi_DMA/data_in]
connect_bd_net [get_bd_pins xlconstant_0/dout] [get_bd_pins sine_wave_gen_0/rst] [get_bd_pins ADC_AFE_interface_0/rst]
connect_bd_net -net xlslice_0_Dout [get_bd_pins SlowControl/fan_en_b] [get_bd_ports fan_en_b]
connect_bd_net [get_bd_pins zynq_ultra_ps_e_0/emio_ttc0_wave_o] [get_bd_pins SlowControl/Din]
connect_bd_net [get_bd_pins zynq_ultra_ps_e_0/pl_clk0] [get_bd_pins SlowControl/ext_spi_clk] [get_bd_pins Clock_Generator/clk_100M_PS]
connect_bd_net [get_bd_pins zynq_ultra_ps_e_0/pl_resetn0] [get_bd_pins Clock_Generator/resetn]
set_property PFM.AXI_PORT {M_AXI_HPM0_FPD {memport "M_AXI_GP" sptag "" memory "" is_range "false"} M_AXI_HPM1_FPD {memport "M_AXI_GP" sptag "" memory "" is_range "false"} S_AXI_HPC0_FPD {memport "S_AXI_HPC" sptag "HPC0" memory "" is_range "false"} S_AXI_HPC1_FPD {memport "S_AXI_HPC" sptag "HPC1" memory "" is_range "false"} S_AXI_HP0_FPD {memport "S_AXI_HP" sptag "HP0" memory "" is_range "false"} S_AXI_HP1_FPD {memport "S_AXI_HP" sptag "HP1" memory "" is_range "false"} S_AXI_HP2_FPD {memport "S_AXI_HP" sptag "HP2" memory "" is_range "false"} S_AXI_HP3_FPD {memport "S_AXI_HP" sptag "HP3" memory "" is_range "false"}} [get_bd_cells zynq_ultra_ps_e_0]

# ---- address map ----
assign_bd_address -offset 0x00000000 -range 2G -target_address_space [get_bd_addr_spaces Axi_DMA/axi_dma_sine/Data_S2MM] [get_bd_addr_segs zynq_ultra_ps_e_0/SAXIGP6/LPD_DDR_LOW]
assign_bd_address -offset 0xC0000000 -range 512M -target_address_space [get_bd_addr_spaces Axi_DMA/axi_dma_sine/Data_S2MM] [get_bd_addr_segs zynq_ultra_ps_e_0/SAXIGP6/LPD_QSPI]
exclude_bd_addr_seg -offset 0x00000000 -range 1 -target_address_space [get_bd_addr_spaces Axi_DMA/axi_dma_sine/Data_S2MM] [get_bd_addr_segs zynq_ultra_ps_e_0/SAXIGP6/LPD_DDR_HIGH]
exclude_bd_addr_seg -offset 0xFF000000 -range 16M -target_address_space [get_bd_addr_spaces Axi_DMA/axi_dma_sine/Data_S2MM] [get_bd_addr_segs zynq_ultra_ps_e_0/SAXIGP6/LPD_LPS_OCM]
assign_bd_address -offset 0x00000000 -range 2G -target_address_space [get_bd_addr_spaces AXI_DMA_Real1_Diff/axi_dma_afe1_diff/Data_S2MM] [get_bd_addr_segs zynq_ultra_ps_e_0/SAXIGP6/LPD_DDR_LOW]
assign_bd_address -offset 0xC0000000 -range 512M -target_address_space [get_bd_addr_spaces AXI_DMA_Real1_Diff/axi_dma_afe1_diff/Data_S2MM] [get_bd_addr_segs zynq_ultra_ps_e_0/SAXIGP6/LPD_QSPI]
exclude_bd_addr_seg -offset 0x00000000 -range 1 -target_address_space [get_bd_addr_spaces AXI_DMA_Real1_Diff/axi_dma_afe1_diff/Data_S2MM] [get_bd_addr_segs zynq_ultra_ps_e_0/SAXIGP6/LPD_DDR_HIGH]
exclude_bd_addr_seg -offset 0xFF000000 -range 16M -target_address_space [get_bd_addr_spaces AXI_DMA_Real1_Diff/axi_dma_afe1_diff/Data_S2MM] [get_bd_addr_segs zynq_ultra_ps_e_0/SAXIGP6/LPD_LPS_OCM]
assign_bd_address -offset 0x00000000 -range 2G -target_address_space [get_bd_addr_spaces AXI_DMA_Real2_Diff/axi_dma_afe2_diff/Data_S2MM] [get_bd_addr_segs zynq_ultra_ps_e_0/SAXIGP6/LPD_DDR_LOW]
assign_bd_address -offset 0xC0000000 -range 512M -target_address_space [get_bd_addr_spaces AXI_DMA_Real2_Diff/axi_dma_afe2_diff/Data_S2MM] [get_bd_addr_segs zynq_ultra_ps_e_0/SAXIGP6/LPD_QSPI]
exclude_bd_addr_seg -offset 0x00000000 -range 1 -target_address_space [get_bd_addr_spaces AXI_DMA_Real2_Diff/axi_dma_afe2_diff/Data_S2MM] [get_bd_addr_segs zynq_ultra_ps_e_0/SAXIGP6/LPD_DDR_HIGH]
exclude_bd_addr_seg -offset 0xFF000000 -range 16M -target_address_space [get_bd_addr_spaces AXI_DMA_Real2_Diff/axi_dma_afe2_diff/Data_S2MM] [get_bd_addr_segs zynq_ultra_ps_e_0/SAXIGP6/LPD_LPS_OCM]
assign_bd_address -offset 0x00000000 -range 2G -target_address_space [get_bd_addr_spaces AXI_DMA_Real3_Diff/axi_dma_afe3_diff/Data_S2MM] [get_bd_addr_segs zynq_ultra_ps_e_0/SAXIGP6/LPD_DDR_LOW]
assign_bd_address -offset 0xC0000000 -range 512M -target_address_space [get_bd_addr_spaces AXI_DMA_Real3_Diff/axi_dma_afe3_diff/Data_S2MM] [get_bd_addr_segs zynq_ultra_ps_e_0/SAXIGP6/LPD_QSPI]
exclude_bd_addr_seg -offset 0x00000000 -range 1 -target_address_space [get_bd_addr_spaces AXI_DMA_Real3_Diff/axi_dma_afe3_diff/Data_S2MM] [get_bd_addr_segs zynq_ultra_ps_e_0/SAXIGP6/LPD_DDR_HIGH]
exclude_bd_addr_seg -offset 0xFF000000 -range 16M -target_address_space [get_bd_addr_spaces AXI_DMA_Real3_Diff/axi_dma_afe3_diff/Data_S2MM] [get_bd_addr_segs zynq_ultra_ps_e_0/SAXIGP6/LPD_LPS_OCM]
assign_bd_address -offset 0x00000000 -range 2G -target_address_space [get_bd_addr_spaces AXI_DMA_Real/axi_dma_afe/Data_S2MM] [get_bd_addr_segs zynq_ultra_ps_e_0/SAXIGP6/LPD_DDR_LOW]
assign_bd_address -offset 0xC0000000 -range 512M -target_address_space [get_bd_addr_spaces AXI_DMA_Real/axi_dma_afe/Data_S2MM] [get_bd_addr_segs zynq_ultra_ps_e_0/SAXIGP6/LPD_QSPI]
exclude_bd_addr_seg -offset 0x00000000 -range 1 -target_address_space [get_bd_addr_spaces AXI_DMA_Real/axi_dma_afe/Data_S2MM] [get_bd_addr_segs zynq_ultra_ps_e_0/SAXIGP6/LPD_DDR_HIGH]
exclude_bd_addr_seg -offset 0xFF000000 -range 16M -target_address_space [get_bd_addr_spaces AXI_DMA_Real/axi_dma_afe/Data_S2MM] [get_bd_addr_segs zynq_ultra_ps_e_0/SAXIGP6/LPD_LPS_OCM]
assign_bd_address -offset 0x0080000000 -range 64K -target_address_space [get_bd_addr_spaces zynq_ultra_ps_e_0/Data] [get_bd_addr_segs Interrupt_Handler/axi_intc_0/S_AXI/Reg]
assign_bd_address -offset 0x0080010000 -range 64K -target_address_space [get_bd_addr_spaces zynq_ultra_ps_e_0/Data] [get_bd_addr_segs Axi_DMA/axi_dma_sine/S_AXI_LITE/Reg]
assign_bd_address -offset 0x0080020000 -range 64K -target_address_space [get_bd_addr_spaces zynq_ultra_ps_e_0/Data] [get_bd_addr_segs AXI_DMA_Real/axi_dma_afe/S_AXI_LITE/Reg]
assign_bd_address -offset 0x0080030000 -range 64K -target_address_space [get_bd_addr_spaces zynq_ultra_ps_e_0/Data] [get_bd_addr_segs SlowControl/axi_quad_spi_0/AXI_LITE/Reg]
assign_bd_address -offset 0x0080040000 -range 64K -target_address_space [get_bd_addr_spaces zynq_ultra_ps_e_0/Data] [get_bd_addr_segs AXI_DMA_Real1_Diff/axi_dma_afe1_diff/S_AXI_LITE/Reg]
assign_bd_address -offset 0x0080050000 -range 64K -target_address_space [get_bd_addr_spaces zynq_ultra_ps_e_0/Data] [get_bd_addr_segs AXI_AFE_iddr_0/S00_AXI/S00_AXI_reg]
assign_bd_address -offset 0x0080060000 -range 64K -target_address_space [get_bd_addr_spaces zynq_ultra_ps_e_0/Data] [get_bd_addr_segs AXI_DMA_Real2_Diff/axi_dma_afe2_diff/S_AXI_LITE/Reg]
assign_bd_address -offset 0x0080070000 -range 64K -target_address_space [get_bd_addr_spaces zynq_ultra_ps_e_0/Data] [get_bd_addr_segs SlowControl/pmod_2/S_AXI/Reg]
assign_bd_address -offset 0x0080080000 -range 64K -target_address_space [get_bd_addr_spaces zynq_ultra_ps_e_0/Data] [get_bd_addr_segs AXI_DMA_Real3_Diff/axi_dma_afe3_diff/S_AXI_LITE/Reg]
assign_bd_address -offset 0x0080090000 -range 64K -target_address_space [get_bd_addr_spaces zynq_ultra_ps_e_0/Data] [get_bd_addr_segs SlowControl/rpi_gpio/S_AXI/Reg]
assign_bd_address -offset 0x00800A0000 -range 64K -target_address_space [get_bd_addr_spaces zynq_ultra_ps_e_0/Data] [get_bd_addr_segs SlowControl/uf_leds/S_AXI/Reg]

validate_bd_design
save_bd_design
